# Altium project Load_CELL.PrjPcb
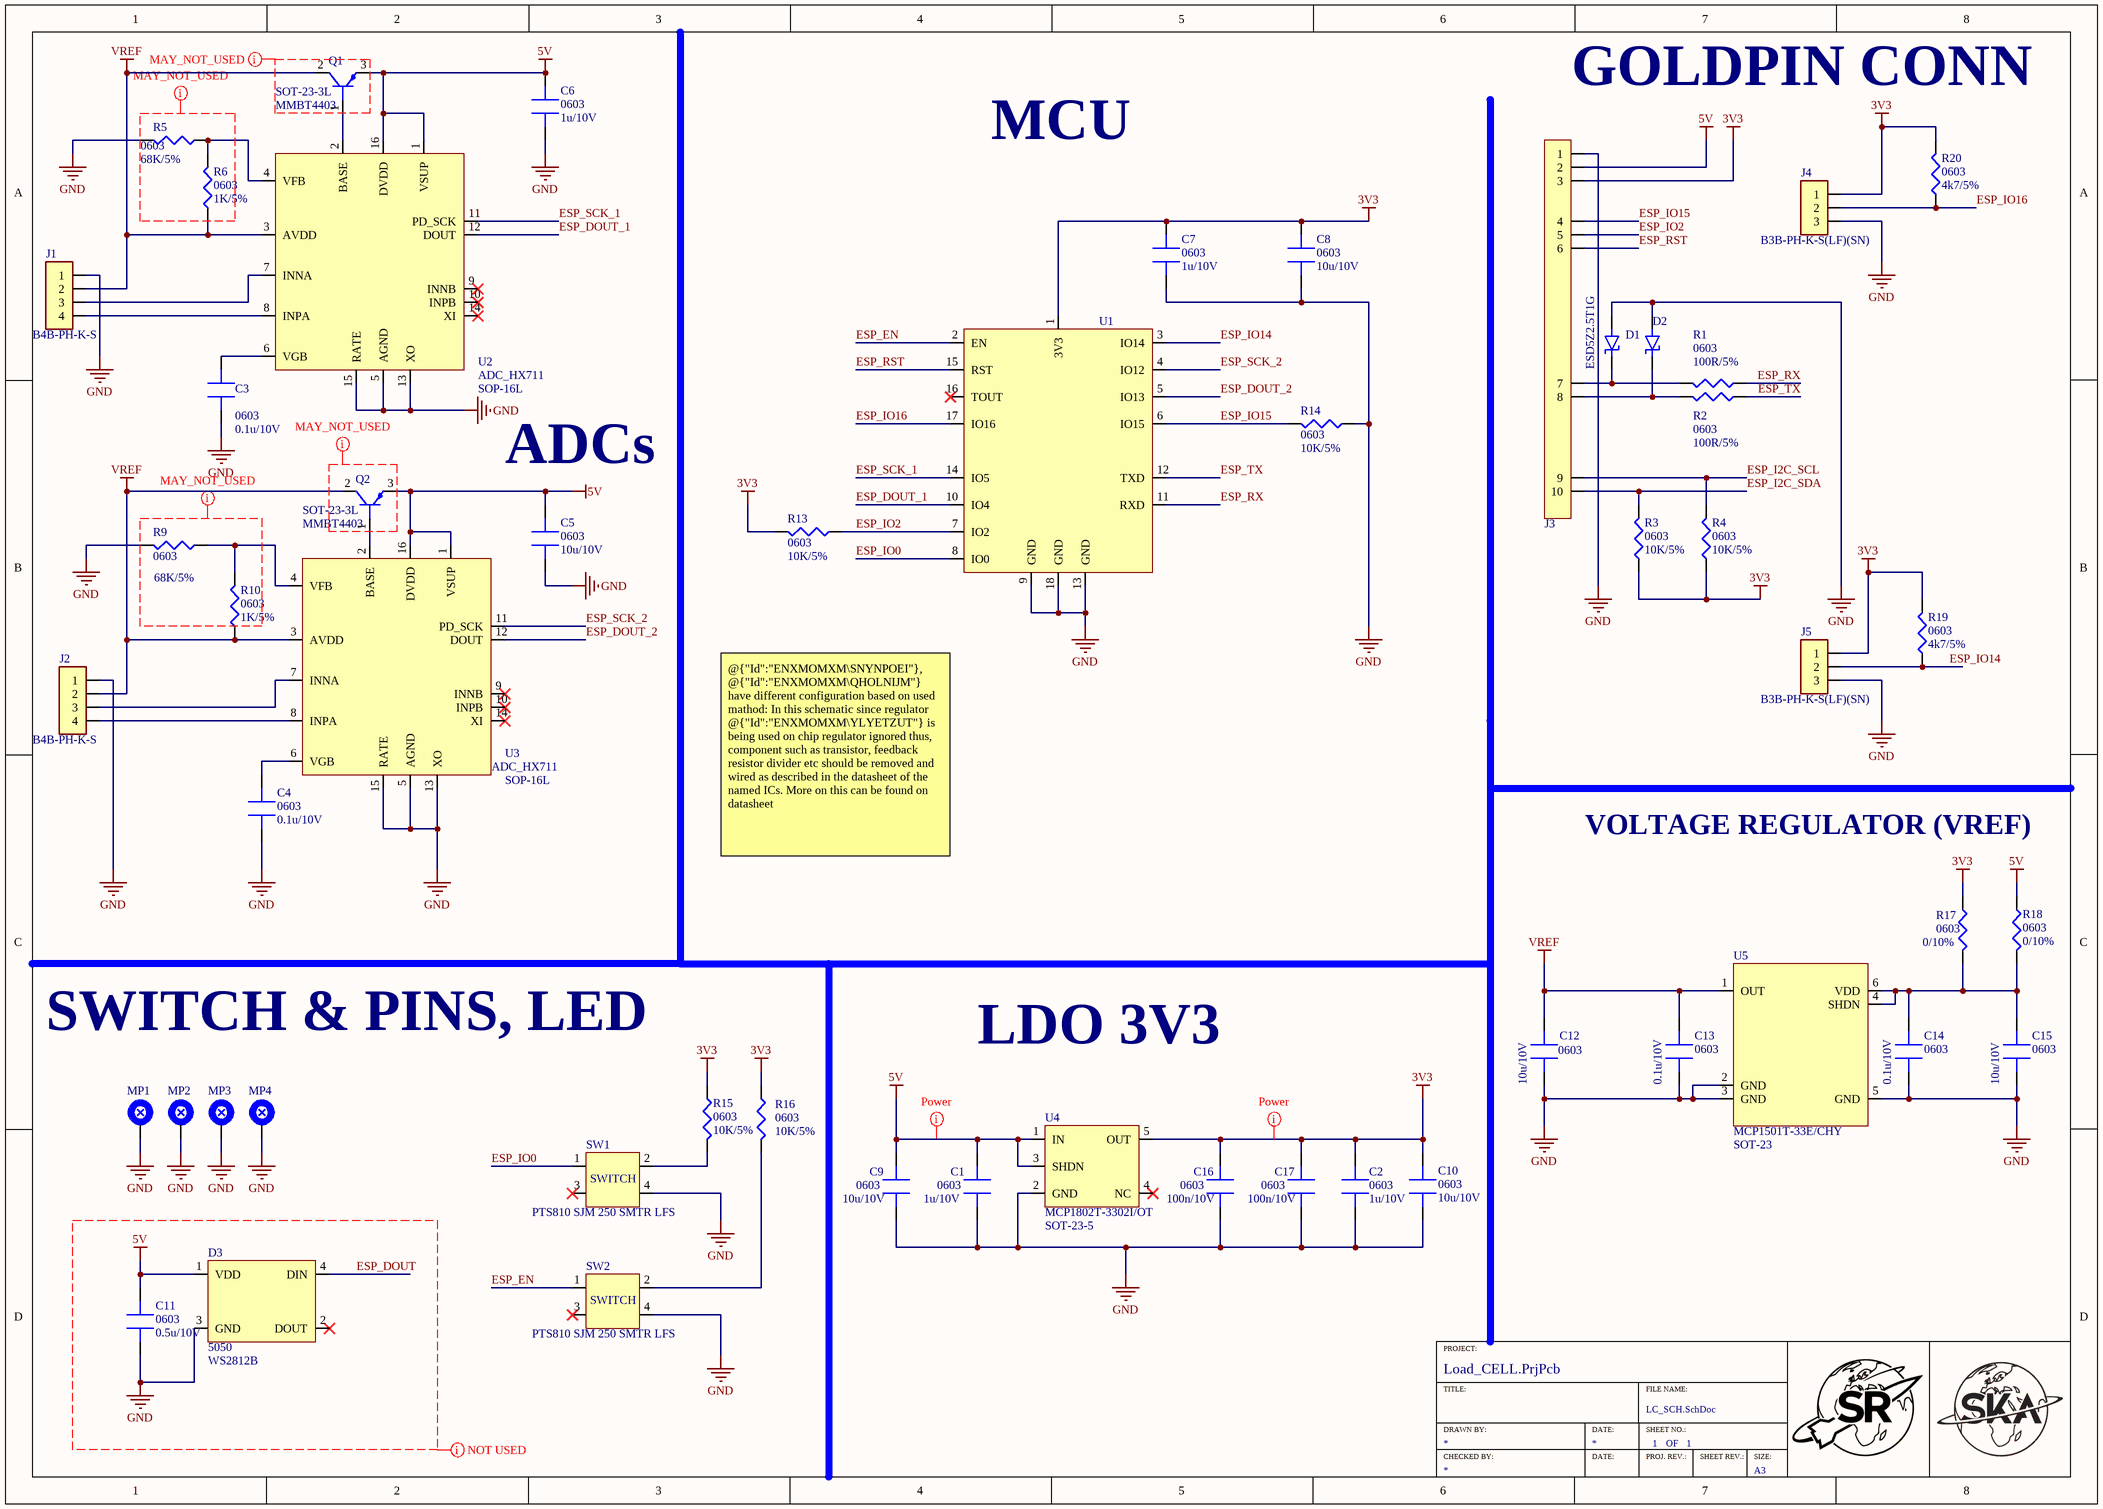
[diagram p0: LC_SCH.SchDoc]
1 sheet, 54 parts. Net scope: global (net labels, ports and power ports of the same name join across sheets).
Board file: LC_PCB.PcbDoc

## Sheet LC_SCH.SchDoc
size A3; Organization: Altium Limited; Address1: L3, 12a Rodborough Rd; Address2: Frenchs Forest; Address3: NSW; Address4: Australia 2086; SheetNumber: 1; SheetTotal: 1

### Parts
C1  value 1u/10V  Package: 0603  [RESC1608X06M[0603]]  (hidden comment: C)
C2  value 1u/10V  Package: 0603  [RESC1608X06M[0603]]  (hidden comment: C)
C3  value 0.1u/10V  Package: 0603  [CAPC1608X09M[0603]]  (hidden comment: C)
C4  value 0.1u/10V  Package: 0603  [CAPC1608X09M[0603]]  (hidden comment: C)
C5  value 10u/10V  Package: 0603  [RESC1608X06M[0603]]  (hidden comment: C)
C6  value 1u/10V  Package: 0603  [RESC1608X06M[0603]]  (hidden comment: C)
C7  value 1u/10V  Package: 0603  [RESC1608X06M[0603]]  (hidden comment: C)
C8  value 10u/10V  Package: 0603  [RESC1608X06M[0603]]  (hidden comment: C)
C9  value 10u/10V  Package: 0603  [RESC1608X06M[0603]]  (hidden comment: C)
C10  value 10u/10V  Package: 0603  [RESC1608X06M[0603]]  (hidden comment: C)
C11  value 0.5u/10V  Package: 0603  [CAPC1608X10L [0603]]  (hidden comment: C)
C12  value 10u/10V  Package: 0603  [RESC1608X06M[0603]]  (hidden comment: C)
C13  value 0.1u/10V  Package: 0603  [CAPC1608X09M[0603]]  (hidden comment: C)
C14  value 0.1u/10V  Package: 0603  [CAPC1608X09M[0603]]  (hidden comment: C)
C15  value 10u/10V  Package: 0603  [RESC1608X06M[0603]]  (hidden comment: C)
C16  value 100n/10V  Package: 0603  [RESC1608X06M[0603]]  (hidden comment: C)
C17  value 100n/10V  Package: 0603  [RESC1608X06M[0603]]  (hidden comment: C)
D1  ESD5Z2.5T1G  [SODFL160X60-2N]
D2  ESD5Z2.5T1G  [SODFL160X60-2N]  (value not drawn)
D3  Package: 5050  [WS2812B]  (hidden comment: WS2812)
J1  PN: B4B-PH-K-S  [JST_PH_B4B-PH-K-S]  (hidden comment: JST_PH_B4B-PH-K-S)
J2  PN: B4B-PH-K-S  [JST_PH_B4B-PH-K-S]  (hidden comment: JST_PH_B4B-PH-K-S)
J3  Gold_Pinx12  [Gold_Pinx10]  (value not drawn)
J4  B3B-PH-K-S(LF)(SN)  [B3B-PH-K-S(LF)(SN)]
J5  B3B-PH-K-S(LF)(SN)  [B3B-PH-K-S(LF)(SN)]
MP1  Mounting hole  [Mounting_hole_M3]  (value not drawn)
MP2  Mounting hole  [Mounting_hole_M3]  (value not drawn)
MP3  Mounting hole  [Mounting_hole_M3]  (value not drawn)
MP4  Mounting hole  [Mounting_hole_M3]  (value not drawn)
Q1  Package: SOT-23-3L  [SOT95P240X120-3N]  (hidden comment: MMBT4403)
Q2  Package: SOT-23-3L  [SOT95P240X120-3N]  (hidden comment: MMBT4403)
R1  value 100R/5%  Package: 0603  [RESC1608X06M[0603]]  (hidden comment: R)
R2  value 100R/5%  Package: 0603  [RESC1608X06M[0603]]  (hidden comment: R)
R3  value 10K/5%  Package: 0603  [RESC1608X06M[0603]]  (hidden comment: R)
R4  value 10K/5%  Package: 0603  [RESC1608X06M[0603]]  (hidden comment: R)
R5  value 68K/5%  Package: 0603  [RESC1608X06M[0603]]  (hidden comment: R)
R6  value 1K/5%  Package: 0603  [RESC1608X06M[0603]]  (hidden comment: R)
R9  value 68K/5%  Package: 0603  [RESC1608X06M[0603]]  (hidden comment: R)
R10  value 1K/5%  Package: 0603  [RESC1608X06M[0603]]  (hidden comment: R)
R13  value 10K/5%  Package: 0603  [RESC1608X06M[0603]]  (hidden comment: R)
R14  value 10K/5%  Package: 0603  [RESC1608X06M[0603]]  (hidden comment: R)
R15  value 10K/5%  Package: 0603  [RESC1608X06M[0603]]  (hidden comment: R)
R16  value 10K/5%  Package: 0603  [RESC1608X06M[0603]]  (hidden comment: R)
R17  value 0/10%  Package: 0603  [RESC1608X06M[0603]]  (hidden comment: R)
R18  value 0/10%  Package: 0603  [RESC1608X06M[0603]]  (hidden comment: R)
R19  value 4k7/5%  Package: 0603  [RESC1608X06M[0603]]  (hidden comment: R)
R20  value 4k7/5%  Package: 0603  [RESC1608X06M[0603]]  (hidden comment: R)
SW1  PTS810 SJM 250 SMTR LFS  [PTS810 SJM 250 SMTR LFS]
SW2  PTS810 SJM 250 SMTR LFS  [PTS810 SJM 250 SMTR LFS]
U1  ESP-WROOM-02 module  [ESP-WROOM-02]  (value not drawn)
U2  ADC_HX711  Package: SOP-16L  [SOP127P600X259-16N]
U3  ADC_HX711  Package: SOP-16L  [SOP127P600X259-16N]
U4  MCP1802T-3302I/OT  Package: SOT-23-5  [SOT95P280X145-5N]
U5  MCP1501T-33E/CHY  Package: SOT-23  [SOT95P280X125-6N]

### Nets
3V3: C2.2 C7.2 C8.2 C10.2 C16.2 C17.2 J3.3 J4.1 J5.1 R3.2 R4.2 R13.1 R15.2 R16.2 R17.2 R19.1 R20.1 U1.1(3V3) U4.5(OUT)
5V: C1.2 C5.2 C6.2 C9.2 C11.2 D3.1(VDD) J3.2 Q1.3 Q2.3 R18.2 U2.1(VSUP) U2.16(DVDD) U3.1(VSUP) U3.16(DVDD) U4.1(IN) U4.3(SHDN)
GND: C1.1 C2.1 C3.1 C4.1 C5.1 C6.1 C7.1 C8.1 C9.1 C10.1 C11.1 C12.1 C13.1 C14.1 C15.1 C16.1 C17.1 D1.2(A) D2.2(A) D3.3(GND) J1.1 J2.1 J3.1 J4.3 J5.3 MP1.1 MP2.1 MP3.1 MP4.1 R5.1 R9.1 R14.2 SW1.4(OUT) SW2.4(OUT) U1.9(GND) U1.13(GND) U1.18(GND) U2.5(AGND) U2.13(XO) U2.15(RATE) U3.5(AGND) U3.13(XO) U3.15(RATE) U4.2(GND) U5.2(GND) U5.3(GND) U5.5(GND)
VREF: C12.2 C13.2 J1.2 J2.2 Q1.2 Q2.2 R6.2 R10.2 U2.3(AVDD) U3.3(AVDD) U5.1(OUT)
ESP_DOUT: D3.4(DIN)
ESP_DOUT_1: U1.10(IO4) U2.12(DOUT)
ESP_DOUT_2: U1.5(IO13) U3.12(DOUT)
ESP_EN: SW2.1(IN) U1.2(EN)
ESP_I2C_SCL: J3.9 R4.1
ESP_I2C_SDA: J3.10 R3.1
ESP_IO0: SW1.1(IN) U1.8(IO0)
ESP_IO2: J3.5 R13.2 U1.7(IO2)
ESP_IO14: J5.2 R19.2 U1.3(IO14)
ESP_IO15: J3.4 R14.1 U1.6(IO15)
ESP_IO16: J4.2 R20.2 U1.17(IO16)
ESP_RST: J3.6 U1.15(RST)
ESP_RX: R1.2 U1.11(RXD)
ESP_SCK_1: U1.14(IO5) U2.11(PD_SCK)
ESP_SCK_2: U1.4(IO12) U3.11(PD_SCK)
ESP_TX: R2.2 U1.12(TXD)
NetC3_2: C3.2 U2.6(VGB)
NetC4_2: C4.2 U3.6(VGB)
NetC14_2: C14.2 C15.2 R17.1 R18.1 U5.4(SHDN) U5.6(VDD)
NetD1_1: D1.1(C) J3.7 R1.1
NetD2_1: D2.1(C) J3.8 R2.1
NetJ1_3: J1.3 U2.7(INNA)
NetJ1_4: J1.4 U2.8(INPA)
NetJ2_3: J2.3 U3.7(INNA)
NetJ2_4: J2.4 U3.8(INPA)
NetQ1_1: Q1.1 U2.2(BASE)
NetQ2_1: Q2.1 U3.2(BASE)
NetR5_2: R5.2 R6.1 U2.4(VFB)
NetR9_2: R9.2 R10.1 U3.4(VFB)
NetR15_1: R15.1 SW1.2(OUT)
NetR16_1: R16.1 SW2.2(OUT)

Not connected (* = marked no-connect by the designer): D3 2(DOUT)*; SW1 3(IN)*; SW2 3(IN)*; U1 16(TOUT)*; U2 9(INNB)* 10(INPB)* 14(XI)*; U3 9(INNB)* 10(INPB)* 14(XI)*; U4 4(NC)*

### Layout directives
net class Power_IN: 5V
mark named NOT USED: 5V, ESP_DOUT, GND
mark named MAY_NOT_USED: (no net found under the mark)
net class POWER_OUT: 3V3

### Notes on the sheet
- GOLDPIN CONN
- MCU
- ADCs
- @{"Id":"ENXMOMXM\SNYNPOEI"}, @{"Id":"ENXMOMXM\QHOLNIJM"} have different configuration based on used mathod: In this schematic since regulator @{"Id":"ENXMOMXM\YLYETZUT"} is being used on chip regulator ignored thus, component such as transistor, feedback resistor divider etc should be removed and wired as described in the datasheet of the named ICs. More on this can be found on datasheet
- VOLTAGE REGULATOR (VREF)
- SWITCH & PINS, LED
- LDO 3V3
- TITLE:
- PROJECT:
- FILE NAME:
- DRAWN BY:
- CHECKED BY:
- DATE:
- SHEET NO.:
- PROJ. REV.:
- OF
- SHEET REV.:
- SIZE:
- A3
- (in symbol PTS810XXXXXXXX) SWITCH

### Library data of the parts
C1-C17 = C: Standard capacitor
D1 D2 = D_Zener: ESD protection diode, 4V; Datasheet: https://www.onsemi.com/pdf/datasheet/esd5z2.5t1-d.pdf; Package: SOD−523; PN: ESD5Z2.5T1G
D3 = WS2812B: RGB LED WS2812B 5050 ,5V.; Datasheet: https://cdn-shop.adafruit.com/datasheets/WS2812B.pdf; PN: WS2812B
J1 J2 = JST_PH_B4B-PH-K-S: JST 4-pin connector, male, vertical, pitch 2.00mm; HelpURL: https://www.tme.eu/Document/bde47a97a79ef7b2143e7f603cd40725/PH.pdf
J3 = Gold_pin: GoldPin Conector x12 pitch 2.54
J4 J5 = B3B-PH-K-S(LF)(SN): Connector Header, PH Series, 3 Position, 2.00mm, Through Hole, Press-Fit, Solder, Natural; Datasheet: https://octopart.com/datasheet/b3b-ph-k-s%28lf%29%28sn%29-jst-248869; HelpURL: https://octopart.com/b3b-ph-k-s%28lf%29%28sn%29-jst-248869
Q1 Q2 = sPNP: Bipolar Transistors - BJT SOT-23 PNP GEN PUR; PN: MMBT4403; Datasheet: https://www.onsemi.com/pdf/datasheet/mmbt4403-d.pdf
R1-R6 R9 R10 R13-R20 = R: Standard resistor
SW1 SW2 = PTS810XXXXXXXX: TACT microswitch; SPST-NO; Pos: 2; 0.05A/16VDC; SMT; lack; Datasheet: https://www.tme.eu/Document/07a775ba34ae8afc76cf6dcf9fe6d1c4/PTS810SJG250SMTRLF.PDF; HelpURL: https://www.tme.eu/pl/details/pts810sjm250smtrlf/mikroprzelaczniki-tact/c-k/pts810-sjm-250-smtr-lfs/
U1 = ESP-WROOM-02: The ESP8266 chip for wi-fi communication in the 2.4 GHz band. 3-3.6V SMD; Datasheet: https://www.espressif.com/sites/default/files/documentation/0c-esp-wroom-02_datasheet_en.pdf; Help_URL: https://botland.store/esp8266-wifi-modules/5391-wifi-system-esp8266-esp-wroom-02-smd-5904422333508.html
U2 U3 = HX711: 24-Bit Analog-to-Digital Converter (ADC) for Weigh Scales; Datasheet: https://cdn.sparkfun.com/datasheets/Sensors/ForceFlex/hx711_english.pdf
U4 = MCP1802T-3302I: LDO Voltage Regulators 200 mA low quiescent current and low noise LDO; Datasheet: https://www.tme.eu/Document/a35250a3ec1de112ad6016307ea8a51d/MCP1802T-1802IO.pdf; HelpUrl: https://www.tme.eu/pl/en/details/mcp1802t-3302io/ldo-unregulated-voltage-regulators/microchip-technology/mcp1802t-3302i-ot/
U5 = MCP1501T-33E/CHY: Voltage References Precision Buffered Voltage Reference; DATA_SHEET: https://www.mouser.pl/datasheet/2/268/MCP1501_Data_Sheet_DS20005474F-2932251.pdf; HELP_LINK: https://www.mouser.pl/ProductDetail/Microchip-Technology-Atmel/MCP1501T-33E-CHY?qs=8cKuZ6Ok2lZxgW6mutm0tA%3D%3D